# EAGLE design SAMD21 Mangler (EAGLE 9.0.1)
COMPANY: Unexpected Maker; DATE: 2018; DRAWN: SEON; REV: 1; TITLE: SMAD21G Mangler
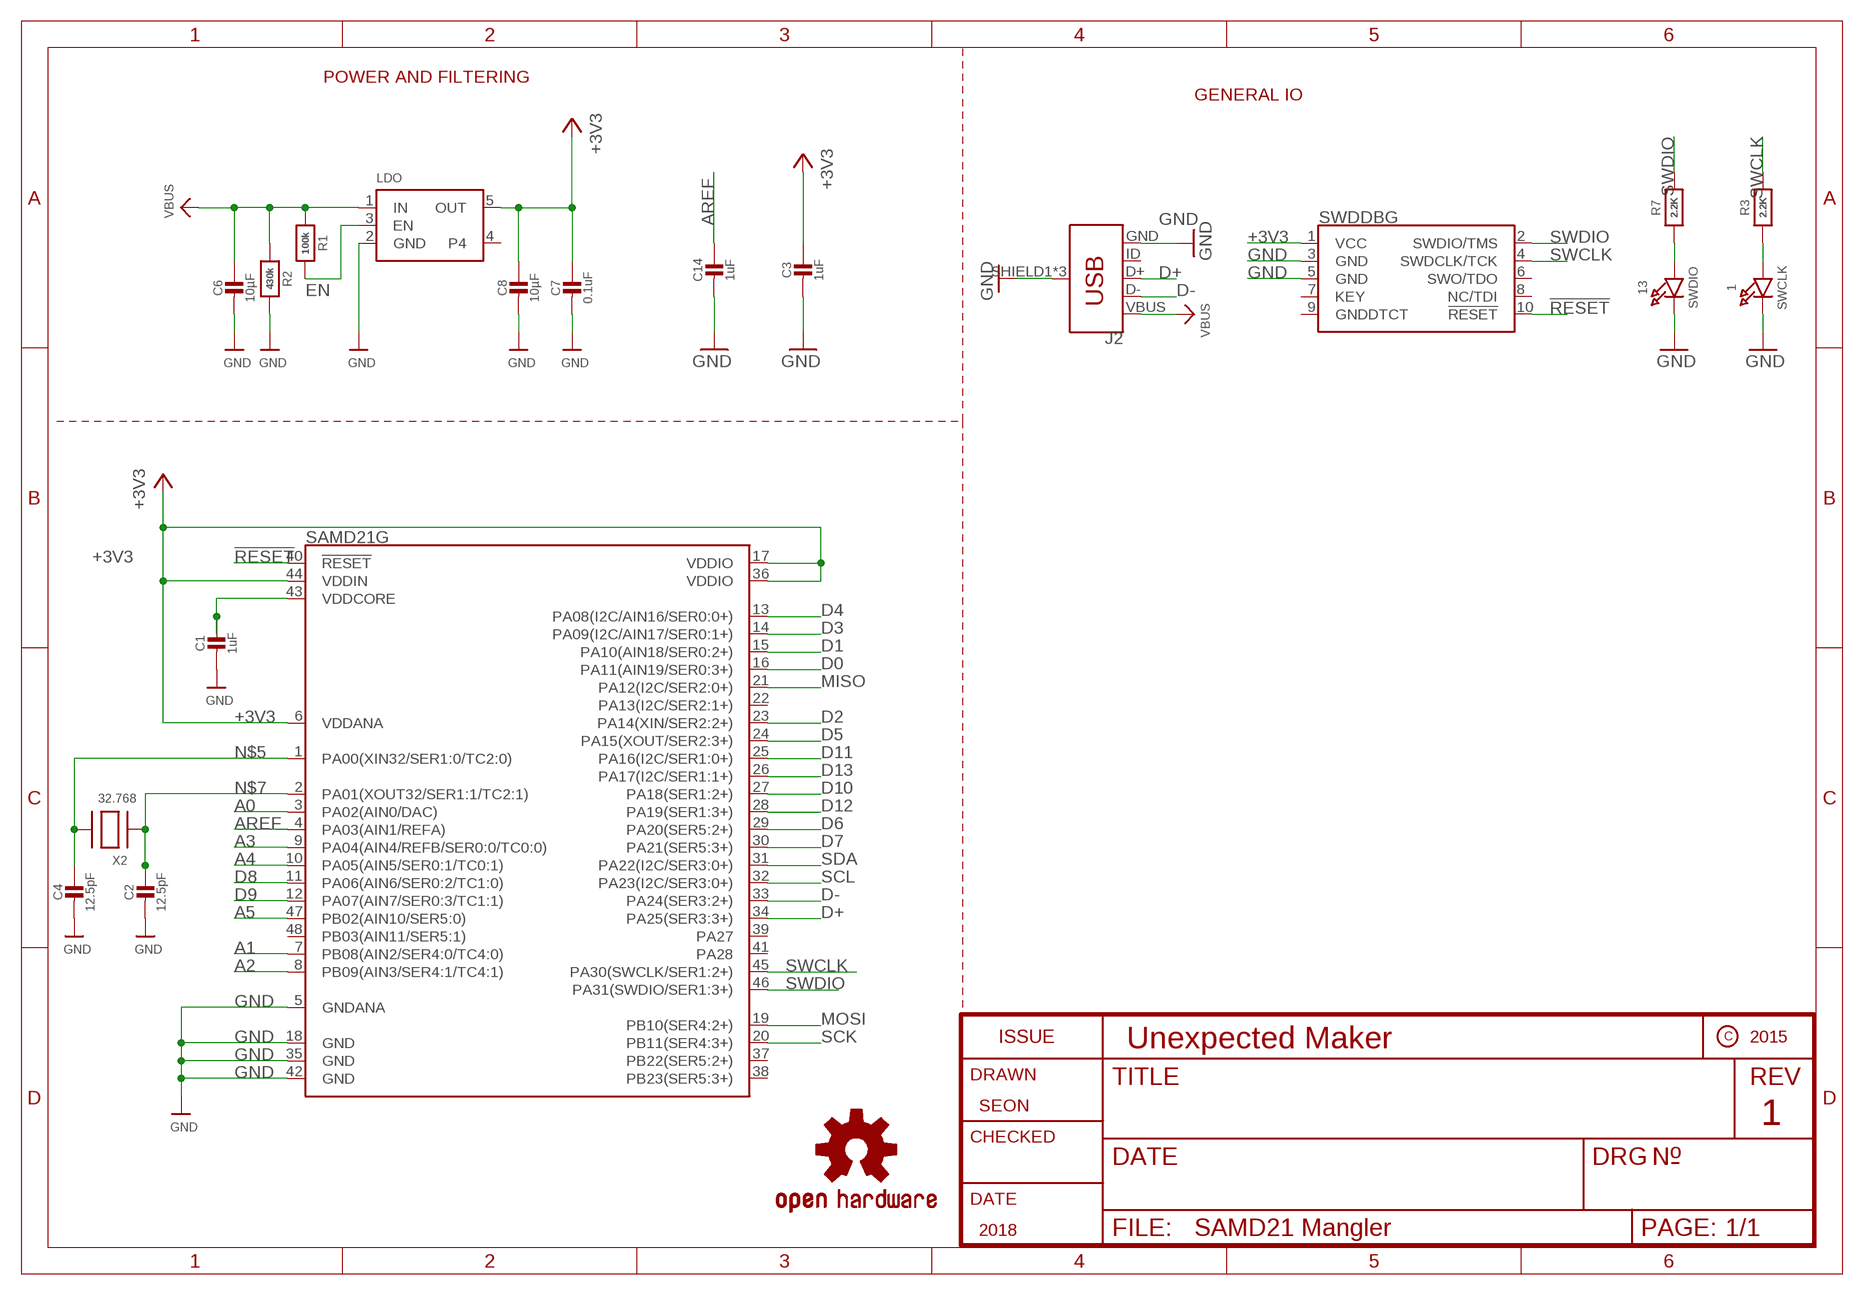
[diagram p0: schematic, sheet 1]

## Parts
1  SWCLK  LED0805_NOOUTLINE  [CHIPLED_0805_NOOUTLINE]
13  SWDIO  LED0805_NOOUTLINE  [CHIPLED_0805_NOOUTLINE]
C1  1uF  CAP_CERAMIC0805-NOOUTLINE  [0805-NO]
C2  12.5pF  CAP_CERAMIC0805-NOOUTLINE  [0805-NO]
C3  1uF  CAP_CERAMIC0805-NOOUTLINE  [0805-NO]
C4  12.5pF  CAP_CERAMIC0805-NOOUTLINE  [0805-NO]
C6  10µF  CAP_CERAMIC0805-NOOUTLINE  [0805-NO]
C7  0.1uF  CAP_CERAMIC0805-NOOUTLINE  [0805-NO]
C8  10µF  CAP_CERAMIC0805-NOOUTLINE  [0805-NO]
C14  1uF  CAP_CERAMIC0805-NOOUTLINE  [0805-NO]
J2  USB_MICRO-BREDUCED_PASTE  [USB-B-MICRO-SMD_RED_PASTE]
LDO  VREG_SOT23-5  [SOT23-5]
LOGO1  OSHW-LOGOS  [OSHW-LOGO-S]
R1  100k  RESISTOR0805_NOOUTLINE  [0805-NO]
R2  430k  RESISTOR0805_NOOUTLINE  [0805-NO]
R3  2.2K  RESISTOR0805_NOOUTLINE  [0805-NO]
R7  2.2K  RESISTOR0805_NOOUTLINE  [0805-NO]
SAMD21G  ATSAMD21G-A  [TQFP-48]
SWDDBG  CORTEX_DEBUG_PTH  [2X5-PTH-1.27MM]
X2  32.768  XTAL-3.2X1.5  [XTAL3215]

## Nets
!RESET: SAMD21G.40(!RESET!) SWDDBG.10(!RESET)
+3V3: C3.1 C7.1 C8.1 LDO.5(OUT) SAMD21G.6(VDDANA) SAMD21G.17(VDDIO) SAMD21G.36(VDDIO) SAMD21G.44(VDDIN) SWDDBG.1(VCC)
A0: SAMD21G.3(PA02(AIN0/DAC))
A1: SAMD21G.7(PB08(AIN2/SER4:0/TC4:0))
A2: SAMD21G.8(PB09(AIN3/SER4:1/TC4:1))
A3: SAMD21G.9(PA04(AIN4/REFB/SER0:0/TC0:0))
A4: SAMD21G.10(PA05(AIN5/SER0:1/TC0:1))
A5: SAMD21G.47(PB02(AIN10/SER5:0))
AREF: C14.1 SAMD21G.4(PA03(AIN1/REFA))
D0: SAMD21G.16(PA11(AIN19/SER0:3+))
D1: SAMD21G.15(PA10(AIN18/SER0:2+))
D2: SAMD21G.23(PA14(XIN/SER2:2+))
D3: SAMD21G.14(PA09(I2C/AIN17/SER0:1+))
D4: SAMD21G.13(PA08(I2C/AIN16/SER0:0+))
D5: SAMD21G.24(PA15(XOUT/SER2:3+))
D6: SAMD21G.29(PA20(SER5:2+))
D7: SAMD21G.30(PA21(SER5:3+))
D8: SAMD21G.11(PA06(AIN6/SER0:2/TC1:0))
D9: SAMD21G.12(PA07(AIN7/SER0:3/TC1:1))
D10: SAMD21G.27(PA18(SER1:2+))
D11: SAMD21G.25(PA16(I2C/SER1:0+))
D12: SAMD21G.28(PA19(SER1:3+))
D13: SAMD21G.26(PA17(I2C/SER1:1+))
D+: J2.D+ SAMD21G.34(PA25(SER3:3+))
D-: J2.D- SAMD21G.33(PA24(SER3:2+))
EN: LDO.3(EN) R1.2
GND: 1.C 13.C C1.2 C2.2 C3.2 C4.2 C6.2 C7.2 C8.2 C14.2 J2.GND J2.SHIELD1(SHIELD) J2.SHIELD2(SHIELD) J2.SHIELD3(SHIELD) LDO.2(GND) R2.2 SAMD21G.5(GNDANA) SAMD21G.18(GND) SAMD21G.35(GND) SAMD21G.42(GND) SWDDBG.3(GND) SWDDBG.5(GND)
MISO: SAMD21G.21(PA12(I2C/SER2:0+))
MOSI: SAMD21G.19(PB10(SER4:2+))
N$1: 1.A R3.2
N$2: 13.A R7.2
N$5: C4.1 SAMD21G.1(PA00(XIN32/SER1:0/TC2:0)) X2.P$2
N$7: C2.1 SAMD21G.2(PA01(XOUT32/SER1:1/TC2:1)) X2.P$1
SCK: SAMD21G.20(PB11(SER4:3+))
SCL: SAMD21G.32(PA23(I2C/SER3:0+))
SDA: SAMD21G.31(PA22(I2C/SER3:0+))
SWCLK: R3.1 SAMD21G.45(PA30(SWCLK/SER1:2+)) SWDDBG.4(SWDCLK/TCK)
SWDIO: R7.1 SAMD21G.46(PA31(SWDIO/SER1:3+)) SWDDBG.2(SWDIO/TMS)
VBUS: C6.1 J2.VBUS LDO.1(IN) R1.1 R2.1
VDDCORE: C1.1 SAMD21G.43(VDDCORE)
Unconnected: J2.ID LDO.4 SAMD21G.22(PA13(I2C/SER2:1+)) SAMD21G.37(PB22(SER5:2+)) SAMD21G.38(PB23(SER5:3+)) SAMD21G.39(PA27) SAMD21G.41(PA28) SAMD21G.48(PB03(AIN11/SER5:1)) SWDDBG.6(SWO/TDO) SWDDBG.7(KEY) SWDDBG.8(NC/TDI) SWDDBG.9(GNDDTCT)

## Notes on the sheet
- POWER AND FILTERING
- GENERAL IO

## Library data of the parts
1 13 = microbuilder:LED: LED 0603 - 0603 Surface Mount Package 2mA: Green LED - Low Power (3.9mcd, 2ma, 1.7Vf) - Digikey: 475-2709-2-ND Orange LED - Low Power (9.8mcd, 2ma, 1.8Vf) - Digikey: 475-1194-2-ND Red LED - Low Power (5mcd, 2ma, 1.8Vf) - Digikey: 475-1195-2-ND Yellow LED - Low Power (7mcd, 2ma, 1.8Vf) - Digikey: 475-1196-2-ND 5mA: Blue LED - Low Power (17mcd, 5ma, 2.9Vf) - Digikey: LNJ937W8CRACT-ND 0805 - 0805 Surface Mount Package 2mA: Red LED (8.8mcd, 2mA, 1.8Vf, Clear) - Low Power [Digikey: 475-2510-1-ND] Green LED (5mcd, 2mA, 1.8Vf, Clear) - Low Power [Digikey: 475-2730-1-ND] Yellow LED (11.3mcd, 2mA, 1.8Vf, Clear) - Low Power [Digikey: 475-2555-1-ND] 20mA: Red LED (104mcd, 20mA, Diffused) - LS R976 [Digikey: 475-1278-6-ND] Red LED (12mcd, 20mA, 2.0Vf, Clear) - APT2012EC [Digikey: 754-1128-1-ND] Green LED (15mcd, 20mA, 2.2Vf, Clear) - APT2012GC [Digikey: 754-1131-1-ND] Orange LED (160mcd, 20mA, 2.1Vf, Clear) - APT2012SECK [Digikey: 754-1130-1-ND] 1206 - 1206 Surface Mount Package Green LED (26mcd, 20mA, Diffused) - LG N971 [Digikey: 475-1407-6-ND] Red LED (15mcd, 20mA, Diffused) - LH N974 [Digikey: 475-1416-6-ND] Cree - Cree High-Power Surface Mount LEDs XPEBWT-L1-0000-00D50 - White 111lm 350mA 2.9Vf 6200K 110° XTEAWT-00-0000-00000LEE3 - White 114lm 350mA 2.85Vf 5000K 115° Everlight - Everlight 45-21 Series Surface Mount LEDs 45-21/QK2C-B2832AC2CB2/2T - Warm White 2000mcd 20mA 3.25Vf 3050K 120° 45-21/LK2C-B38452C4CB2/2T - Nuetral White 2000mcd 20mA 3.25Vf 4150K 120° 45-21/LK2C-B50634C6CB2/2T - Cold White 2200mcd 20mA 3.25Vf 5650K 120° PLCC2 Reverse Mount LS T77K-J1L2-1-0-2-R18-Z - Red 11.25mcd 2mA 1.8Vf 630nm 120° LO T77K-L1M2-24-Z - Orange 19.6mcd 2mA 1.8Vf 606nm 120° LY T77K-K2M1-26-Z - Yellow 15.7mcd 2mA 1.8Vf 587nm 120°
C1-C4 C6-C8 C14 = microbuilder:CAP_CERAMIC: Ceramic Capacitors For new designs, use the packages preceded by an '_' character since they are more reliable: The following footprints should be used on most boards: _0402 - Standard footprint for regular board layouts _0603 - Standard footprint for regular board layouts _0805 - Standard footprint for regular board layouts _1206 - Standard footprint for regular board layouts For extremely tight-pitch boards where space is at a premium, the following 'micro-pitch' footprints can be used (smaller pads, no silkscreen outline, etc.): _0402MP - Micro-pitch footprint for very dense/compact boards _0603MP - Micro-pitch footprint for very dense/compact boards _0805MP - Micro-pitch footprint for very dense/compact boards _1206MP - Micro-pitch footprint for very dense/compact boards
J2 = SparkFun-Connectors:USB_MICRO-B: USB Type Micro-B Connector Male/female and PTH/SMT variants SparkFun Products: SparkFun microB USB Breakout <https://www.sparkfun.com/products/12035> SparkFun USB microB Plug Breakout <https://www.sparkfun.com/products/10031> SparkFun ESP8266 Thing <https://www.sparkfun.com/products/13231>; PROD_ID: CONN-11752; SPICEPREFIX: X
LDO = microbuilder:VREG_SOT23-5: SOT23-5 Fixed Voltage Regulators Part Current Out V Out V In V Dropout θJA (°C/W) TJ (°C) Digikey Part No. ADP121 150mA 3.3V 3.4-5.5V 0.09V @ 150mA -- -- ADP121-AUJZ33R7CT-ND ADP121 150mA 3.0V 3.1-5.5V 0.09V @ 150mA -- -- ADP121-AUJZ30R7CT-ND ADP122 300mA 3.3V 3.4-5.5V 0.085V @ 300mA -- -- ADP122AUJZ-3.3-R7CT-ND ADP1712 300mA 3.3V 3.5-5.5V 0.17V @ 300mA -- -- ADP1712AUJZ-3.3-R7TR-ND AP7311 (Low Cost) 150mA 3.3V 3.5-6V 0.15V @ 150mA -- -- AP7311-33WG-7DICT-ND LD39015M18R 150mA 1.8V 1.9V-5.5V 0.08V @ 100mA -- -- 497-6977-1-ND LP2985A-33DBVR 150mA 3.3V 3.3-16V 0.28V @ 150mA 206 150 296-18479-1-ND MCP1824T-3302E/OT 300mA 3.3V 3.5V-6V 0.2V @ 300mA -- -- MCP1824T-3302E/OTCT-ND MIC5205-2.5YM5 TR 150mA 2.5V 2.7-16V 0.165V @ 150mA -- -- 576-1257-2-ND MIC5205-3.0YM5 TR 150mA 3.0V 3.2V-16V 0.165V @ 150mA -- -- 576-1258-2-ND MIC5205-3.3YM5 TR 150mA 3.3V 3.5V-16V 0.165V @ 150mA -- -- 576-1259-2-ND TPS780330220 150mA 3.3V+2.2V 3.6-5.5V 250mV Max -- -- 296-23332-1-ND TDA3663/N1,135 100mA 3.3V 3.5-45V 0.18V @ 50mA -- -- 568-5343-1-ND Max operating temp can be calculated using θJA, TJ (max junction temperature), and power in watts. Set the "Maximum Ambient Temperature" until it reaches TJ ("Max Junction Temperature"), which is the absolute limit for safe use of the regulator: Heat Sink Temperature Calculator <http://www.daycounter.com/Calculators/Heat-Sink-Temperature-Calculator.phtml> For example, With 12V source into a 3.3V LP2985 and a 30mA load, we are dissipating (12V-3.3V) * 0.03A = 0.261W. With a θJA of 206 °C/W, a TJ of 150°C, and 261mW we can safely use the chip without a heat sink up to 75°C (=147.1°C Junction Temperature).
LOGO1 = SparkFun-Aesthetics:OSHW-LOGO: Open-Source Hardware (OSHW) Logo This logo indicates the piece of hardware it is found on incorporates a OSHW license and/or adheres to the definition of open source hardware found here: http://freedomdefined.org/OSHW
R1-R3 R7 = microbuilder:RESISTOR: Resistors For new designs, use the packages preceded by an '_' character since they are more reliable: The following footprints should be used on most boards: _0402 - Standard footprint for regular board layouts _0603 - Standard footprint for regular board layouts _0805 - Standard footprint for regular board layouts _1206 - Standard footprint for regular board layouts For extremely tight-pitch boards where space is at a premium, the following 'micro-pitch' footprints can be used (smaller pads, no silkscreen outline, etc.): _0402MP - Micro-pitch footprint for very dense/compact boards _0603MP - Micro-pitch footprint for very dense/compact boards _0805MP - Micro-pitch footprint for very dense/compact boards _1206MP - Micro-pitch footprint for very dense/compact boards
SAMD21G = SparkFun-IC-Microcontroller:ATSAMD21G: Atmel SAMD21G SMART ARM-Based Microcontroller The Atmel ® | SMART ™ SAM D21 is a series of low-power microcontrollers using the 32-bit ARM ® Cortex ® -M0+ processor, and ranging from 32- to 64-pins with up to 256KB Flash and 32KB of SRAM. The SAM D21 devices operate at a maximum frequency of 48MHz and reach 2.46 CoreMark/MHz. They are designed for simple and intuitive migration with identical peripheral modules, hex compatible code, identical linear address map and pin compatible migration paths between all devices in the product series. All devices include intelligent and flexible peripherals, Atmel Event System for inter-peripheral signaling, and support for capacitive touch button, slider and wheel user interfaces. Datasheet <https://cdn.sparkfun.com/datasheets/Dev/Arduino/Boards/Atmel-42181-SAM-D21_Datasheet.pdf> SparkFun Products SparkFun SAMD21 Mini Breakout <https://www.sparkfun.com/products/13664> (DEV-13664) SparkFun SAMD21 Dev Breakout <https://www.sparkfun.com/products/13672> (DEV-13672); PROD_ID: IC-13064
SWDDBG = SparkFun-Connectors:CORTEX_DEBUG: Cortex Debug Connector - 10 pin Supports JTAG debug, Serial Wire debug, and Serial Wire Viewer. PTH and SMD connector options available. General Connector Information <http://infocenter.arm.com/help/topic/com.arm.doc.faqs/attached/13634/cortex_debug_connectors.pdf> Products: PTH Connector <http://www.digikey.com/product-detail/en/cnc-tech/3220-10-0100-00/1175-1627-ND/3883661> -via Digi-Key SparkFun PSoc <https://www.sparkfun.com/products/13229> SparkFun T <https://www.sparkfun.com/products/13810>
X2 = adafruit2:XTAL: Low cost SMT crystals, no capacitors included http://www.ladyada.net/library/eagle

## Net classes
0 default: width 0.203 mm, drill 0.406 mm, clearance 0.203 mm

## Board
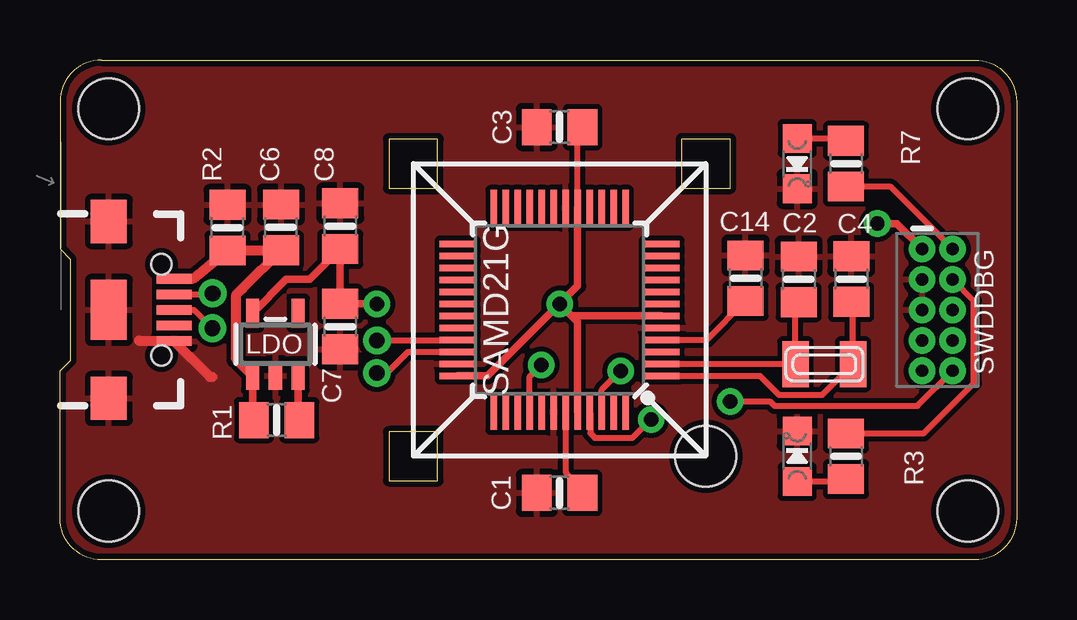
[diagram p1: board, top side]
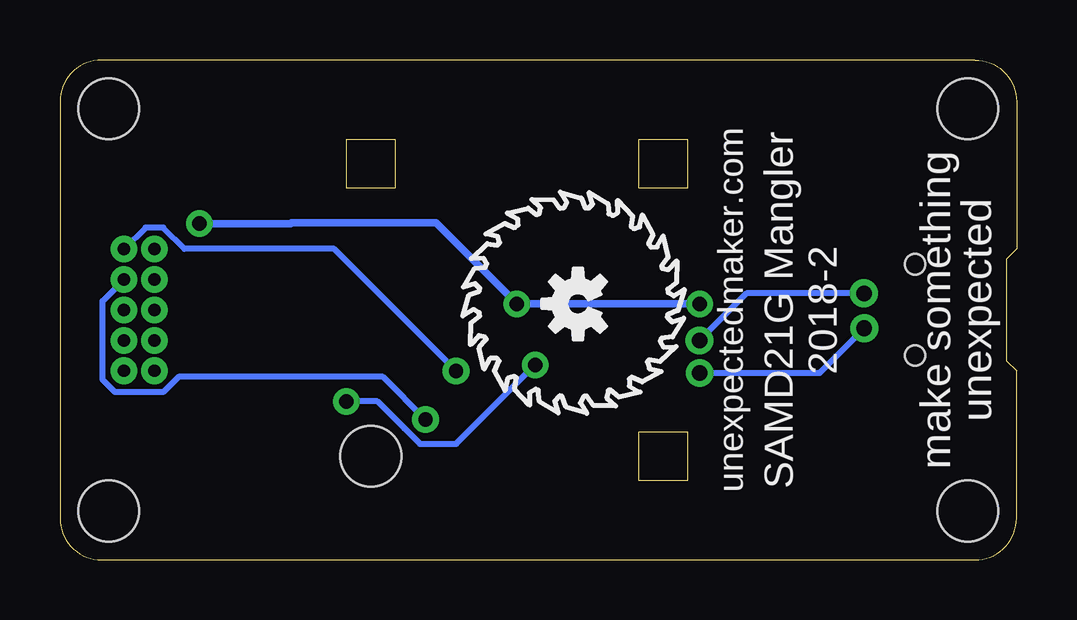
[diagram p2: board, bottom side, seen from below]

Size 39.88 x 20.83 mm. Coordinates in mm from the lower left corner, seen from the top.
Outline: 1.73,20.83 38.14,20.83 arc-90 39.88,19.09 39.88,1.73 arc-90 38.14,0 1.73,0 arc-90 0,1.73 0,7.87 0.43,8.31 0.43,12.52 0,12.95 0,19.09 arc-90 1.73,20.83
Outline: 13.72,17.53 13.72,15.49 15.75,15.49 15.75,17.53 13.72,17.53
Outline: 25.91,17.53 25.91,15.49 27.94,15.49 27.94,17.53 25.91,17.53
Outline: 13.72,5.33 13.72,3.3 15.75,3.3 15.75,5.33 13.72,5.33
Copper layers (1*16): Top 0.035mm / dielectric 1.5mm / Bottom 0.035mm
Design rules "SparkFun": minimum track width 8mil, minimum drill 20mil, track to track 8mil, track to pad 8mil, pad to pad 8mil, via to via 8mil, smd to smd 8mil, copper to edge 10mil, drill to drill 8mil, minimum pad ring 12mil, minimum via ring 10mil, stop-mask expansion 4mil, vias tented up to drill 25mil, thermal gap 10mil
Holes 2.54 mm at 26.92,4.32 2.03,18.8 2.03,2.03 37.85,18.8 37.85,2.03

### Footprints (pad centres in the part's own frame; a part is rotated, then mirrored left to right if it is on the bottom)
CHIPLED_0805_NOOUTLINE = smd 1.2 x 1.2: A 0,-1.05; C 0,1.05
0805-NO = smd 1.24 x 1.5: 1 -0.95,0; 2 0.95,0
USB-B-MICRO-SMD_RED_PASTE = smd 1.45 x 0.4: D+ 2.725,0; D- 2.725,0.65; GND 2.725,-1.3; ID 2.725,-0.65; VBUS 2.725,1.3 | smd 1.5 x 1.8: SHIELD1 0,3.685; SHIELD2 0,-3.685 | smd 1.5 x 2.5: SHIELD3 0,0 | hole 0.85: 2.2,1.9; 2.2,-1.9
SOT23-5 = smd 0.55 x 1.2: 1 -0.95,-1.3; 2 0,-1.3; 3 0.95,-1.3; 4 0.95,1.3; 5 -0.95,1.3
TQFP-48 = smd 1.5 x 0.28: 1 -4.25,2.75; 2 -4.25,2.25; 3 -4.25,1.75; 4 -4.25,1.25; 5 -4.25,0.75; 6 -4.25,0.25; 7 -4.25,-0.25; 8 -4.25,-0.75; 9 -4.25,-1.25; 10 -4.25,-1.75; 11 -4.25,-2.25; 12 -4.25,-2.75; 25 4.25,-2.75; 26 4.25,-2.25; 27 4.25,-1.75; 28 4.25,-1.25; 29 4.25,-0.75; 30 4.25,-0.25; 31 4.25,0.25; 32 4.25,0.75; 33 4.25,1.25; 34 4.25,1.75; 35 4.25,2.25; 36 4.25,2.75 | smd 0.28 x 1.5: 13 -2.75,-4.25; 14 -2.25,-4.25; 15 -1.75,-4.25; 16 -1.25,-4.25; 17 -0.75,-4.25; 18 -0.25,-4.25; 19 0.25,-4.25; 20 0.75,-4.25; 21 1.25,-4.25; 22 1.75,-4.25; 23 2.25,-4.25; 24 2.75,-4.25; 37 2.75,4.25; 38 2.25,4.25; 39 1.75,4.25; 40 1.25,4.25; 41 0.75,4.25; 42 0.25,4.25; 43 -0.25,4.25; 44 -0.75,4.25; 45 -1.25,4.25; 46 -1.75,4.25; 47 -2.25,4.25; 48 -2.75,4.25
2X5-PTH-1.27MM = drill 0.508 pad 1: 1 -2.54,-0.635; 2 -2.54,0.635; 3 -1.27,-0.635; 4 -1.27,0.635; 5 0,-0.635; 6 0,0.635; 7 1.27,-0.635; 8 1.27,0.635; 9 2.54,-0.635; 10 2.54,0.635
XTAL3215 = smd 1.1 x 1.9: P$1 1.2,0; P$2 -1.2,0

### Placement (x,y rotation side)
1  30.73,4.32 0 top
13  30.73,16.51 180 top
C1  20.83,2.79 180 top
C2  30.8,11.69 90 top
C3  20.83,18.03 180 top
C4  32.99,11.7 90 top
C6  9.21,13.86 90 top
C7  11.68,9.72 270 top
C8  11.68,13.91 90 top
C14  28.58,11.74 90 top
J2  2.03,10.41 0 top
LDO  8.98,8.98 0 top
LOGO1  18.29,10.67 90 bottom
R1  9.03,5.83 0 top
R2  6.98,13.84 90 top
R3  32.77,4.32 270 top
R7  32.77,16.51 90 top
SAMD21G  20.83,10.41 180 top
SWDDBG  36.58,10.41 270 top
X2  31.86,8.15 180 top

### Tracks (layer width: path | path; a pad name or v marks a point on that pad's centre or on a via)
!RESET  (via drill 0.6)
  Top 0.254: SAMD21G.40 19.58,7.64 v20.07,8.13 | v27.94,6.6 29.59,6.6 29.79,6.41 35.75,6.41 SWDDBG.10
  Bottom 0.254: v20.07,8.13 23.37,4.83 24.87,4.83 25.52,5.48 25.52,5.49 26.64,6.6 v27.94,6.6
+3V3  (via drill 0.6)
  Top 0.254: SAMD21G.17 21.58,17.83 C3.1
  Top 0.305: LDO.5 9.43,11.68 10.41,11.68 C8.1 C7.1 v13.21,10.67 | v20.83,10.67 21.58,11.42 SAMD21G.17 | SAMD21G.36 17.82,7.66 v20.83,10.67 | SAMD21G.6 21.33,10.16 v20.83,10.67 | SAMD21G.44 21.58,9.92 v20.83,10.67 | SWDDBG.1 34.89,14.01 v34.07,14.01
  Bottom 0.305: v13.21,10.67 v20.83,10.67 24.21,14.05 30.23,14.05 30.26,14.01 v34.07,14.01
AREF
  Top 0.254: SAMD21G.4 26.96,9.16 C14.1
D+  (via drill 0.65)
  Top 0.254: J2.D+ 5.59,10.41 v6.35,9.65 | v13.21,7.78 13.62,7.78 14.51,8.66 SAMD21G.34
  Bottom 0.254: v6.35,9.65 8.22,7.78 v13.21,7.78
D-  (via drill 0.65)
  Top 0.254: J2.D- 6.32,11.06 v6.36,11.11 | v13.22,9.14 16.56,9.14 SAMD21G.33
  Bottom 0.254: v6.36,11.11 11.25,11.11 v13.22,9.14
EN
  Top 0.305: LDO.3 9.93,5.88 R1.2
GND
  Top 0.406: 6.35,7.62 6.25,7.62 J2.GND 3.33,9.11 3.3,9.14
  pour Top: -0.51,28.19 -0.51,-0.76 40.64,-0.76 40.64,28.19
N$1
  Top 0.254: 1.A 32.67,3.27 R3.2
N$2
  Top 0.254: 13.A 32.67,17.56 R7.2
N$5
  Top 0.254: SAMD21G.1 29.18,7.66 29.97,6.87 31.78,6.87 X2.P$2 33.06,10.68 C4.1
N$7
  Top 0.254: SAMD21G.2 30.65,8.16 X2.P$1 30.66,10.6 C2.1
SWCLK  (via drill 0.6)
  Top 0.254: SAMD21G.45 22.11,6.13 22.11,5.28 22.3,5.08 23.86,5.08 24.61,5.84 v24.64,5.84 | SWDDBG.4 37.21,11.67 38.1,10.78 38.1,7.37 36,5.27 R3.1
  Bottom 0.254: v24.64,5.84 26.42,7.62 34.94,7.62 35.57,6.99 37.58,6.99 38.1,7.51 38.1,10.78 37.21,11.67 SWDDBG.4
SWDIO  (via drill 0.6)
  Top 0.254: SAMD21G.46 22.58,7.08 v23.37,7.87 | R7.1 34.61,15.56 SWDDBG.2
  Bottom 0.254: v23.37,7.87 28.45,12.95 34.68,12.95 35.57,13.84 36.31,13.84 37.2,12.95 SWDDBG.2
VBUS
  Top 0.305: 6.98,12.67 R2.1 | LDO.1 8.03,5.88 R1.1
  Top 0.406: 4.67,11.71 J2.VBUS 5.55,11.71 R2.1 9.2,12.89 C6.1 7.6,11.29 7.59,11.29 7.35,11.05 7.35,8.36 LDO.1
VDDCORE
  Top 0.254: 21.09,6.15 SAMD21G.43 21.08,3.65 C1.1

### Text on the board
bPlace: make something / unexpected | SAMD21G Mangler / 2018-2 | unexpectedmaker.com